# EAGLE design k1fm_wspr_tx-1.1 (EAGLE 9.2.2)
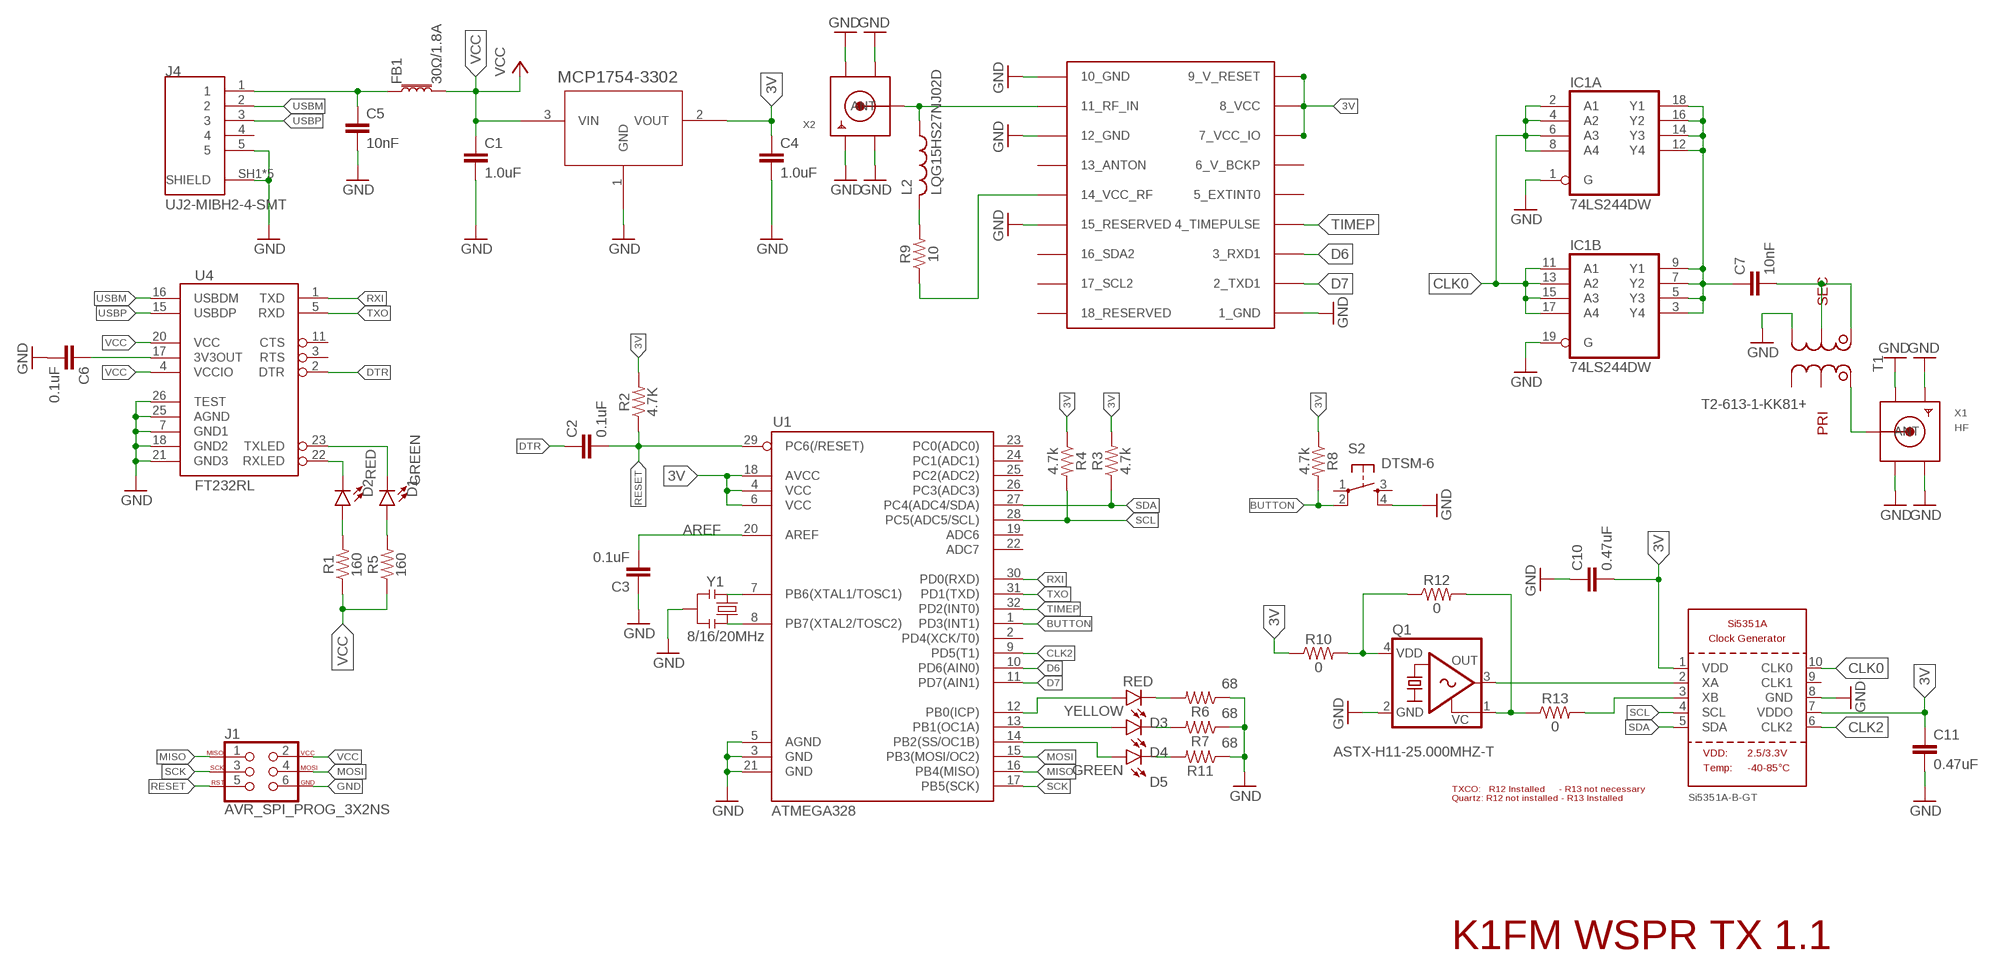
[diagram p0: schematic, sheet 1]

## Parts
C1  1.0uF  1.0UF-0603-16V-10%  [0603]
C2  0.1uF  0.1UF-0603-25V-5%  [0603]
C3  0.1uF  0.1UF-0603-25V-5%  [0603]
C4  1.0uF  1.0UF-0603-16V-10%  [0603]
C5  10nF  1.0UF-0603-16V-10%  [0603]
C6  0.1uF  0.1UF-0603-25V-5%  [0603]
C7  10nF  1.0UF-0603-16V-10%  [0603]
C10  0.47uF  0.1UF-0603-25V-5%  [0603]
C11  0.47uF  0.1UF-0603-25V-5%  [0603]
D1  GREEN  LED0603  [LED-0603]
D2  RED  LED0603  [LED-0603]
D3  RED  LED0603  [LED-0603]
D4  YELLOW  LED0603  [LED-0603]
D5  GREEN  LED0603  [LED-0603]
FB1  30Ω/1.8A  FERRITE_BEAD-0603  [0603]
GPS1  UBLOX_MAX  [UBLOX_MAX]
IC1  74LS244DW  [SO20W]
J1  AVR_SPI_PROG_3X2NS  [2X3-NS]
J4  UJ2-MIBH2-4-SMT  [CUI_UJ2-MIBH2-4-SMT]
L2  LQG15HS27NJ02D  INDUCTOR_0402_M  [RESC0402_M]
Q1  ASTX-H11-25.000MHZ-T  KXO-VCXO-SINE-84  [3.2X2.5_KXO-84]
R1  160  4.7KOHM-0603-1/10W-1%  [0603]
R2  4.7K  10KOHM-0603-1/10W-1%  [0603]
R3  4.7k  4.7KOHM-0603-1/10W-1%  [0603]
R4  4.7k  4.7KOHM-0603-1/10W-1%  [0603]
R5  160  4.7KOHM-0603-1/10W-1%  [0603]
R6  68  4.7KOHM-0603-1/10W-1%  [0603]
R7  68  4.7KOHM-0603-1/10W-1%  [0603]
R8  4.7k  4.7KOHM-0603-1/10W-1%  [0603]
R9  10  10KOHM-0603-1/10W-1%  [0603]
R10  0  4.7KOHM-0603-1/10W-1%  [0603]
R11  68  4.7KOHM-0603-1/10W-1%  [0603]
R12  0  4.7KOHM-0603-1/10W-1%  [0603]
R13  0  4.7KOHM-0603-1/10W-1%  [0603]
S2  DTSM-6  [DTSM-6]
T1  T2-613-1-KK81+  TT1-6  [KK81]
U1  ATMEGA328  ATMEGA168  [TQFP32-08]
U2  Si5351A-B-GT  SI5351A  [MSOP10]
U3  MCP1754X-XXXXX/C  [SOT-23A_MC]
U4  FT232RL  FT232RL-BASICSSOP  [SSOP28DB]
X1  HF  SMACONNECTOR_EDGE  [SMA_EDGELAUNCH]
X2  SMACONNECTOR_EDGE  [SMA_EDGELAUNCH]
Y1  8/16/20MHz  RESONATOR1:1  [RESONATOR-SMD-1:1]

## Nets
3V: C4.1 C10.2 C11.1 GPS1.7_VCC_IO GPS1.8_VCC GPS1.9_V_RESET R2.2 R3.2 R4.1 R8.1 R10.1 U1.4(VCC) U1.6(VCC) U1.18(AVCC) U2.1(VDD) U2.7(VDDO) U3.2(VOUT)
AREF: C3.2 U1.20(AREF)
BUTTON: R8.2 S2.2 U1.1(PD3(INT1))
CLK0: IC1.2(A:A1) IC1.4(A:A2) IC1.6(A:A3) IC1.8(A:A4) IC1.11(B:A1) IC1.13(B:A2) IC1.15(B:A3) IC1.17(B:A4) U2.10(CLK0)
CLK2: U1.9(PD5(T1)) U2.6(CLK2)
D6: GPS1.3_RXD1 U1.10(PD6(AIN0))
D7: GPS1.2_TXD1 U1.11(PD7(AIN1))
DTR: C2.1 U4.2(DTR)
GND: C1.2 C3.1 C4.2 C5.2 C6.2 C10.1 C11.2 GPS1.1_GND GPS1.10_GND GPS1.12_GND GPS1.15_RESERVED IC1.1(A:G) IC1.19(B:G) J1.6 J4.5 J4.SH1(SHIELD) J4.SH2(SHIELD) J4.SH3(SHIELD) J4.SH4(SHIELD) J4.SH5(SHIELD) Q1.2(GND) R6.1 R7.1 R11.1 S2.4 T1.1(S2) U1.3(GND) U1.5(AGND) U1.21(GND) U2.8(GND) U3.1(GND) U4.7(GND1) U4.18(GND2) U4.21(GND3) U4.25(AGND) U4.26(TEST) X1.GND@1(GND4) X1.GND@2(GND3) X1.GND@3(GND2) X1.GND@4(GND1) X2.GND@1(GND4) X2.GND@2(GND3) X2.GND@3(GND2) X2.GND@4(GND1) Y1.2
MISO: J1.1 U1.16(PB4(MISO))
MOSI: J1.4 U1.15(PB3(MOSI/OC2))
N$1: GPS1.11_RF_IN L2.1 X2.P(ANT)
N$2: D2.C U4.22(RXLED)
N$3: C7.1 IC1.3(B:Y4) IC1.5(B:Y3) IC1.7(B:Y2) IC1.9(B:Y1) IC1.12(A:Y4) IC1.14(A:Y3) IC1.16(A:Y2) IC1.18(A:Y1)
N$4: T1.4(P1) X1.P(ANT)
N$5: C7.2 T1.2(ST) T1.3(S1)
N$6: Q1.3(OUT) U2.2(XA)
N$7: D1.C U4.23(TXLED)
N$8: C5.1 FB1.1 J4.1
N$9: D2.A R1.2
N$10: D1.A R5.2
N$11: D3.A U1.12(PB0(ICP))
N$12: D4.A U1.13(PB1(OC1A))
N$13: D3.C R6.2
N$14: C6.1 U4.17(3V3OUT)
N$15: D4.C R7.2
N$16: Q1.4(VDD) R10.2 R12.1
N$17: L2.2 R9.2
N$18: GPS1.14_VCC_RF R9.1
N$21: D5.A U1.14(PB2(SS/OC1B))
N$22: D5.C R11.2
N$23: R13.2 U2.3(XB)
N$25: Q1.1(VC) R12.2 R13.1
N$28: U1.8(PB7(XTAL2/TOSC2)) Y1.3
N$29: U1.7(PB6(XTAL1/TOSC1)) Y1.1
RESET: C2.2 J1.5 R2.1 U1.29(PC6(/RESET))
RXI: U1.30(PD0(RXD)) U4.1(TXD)
SCK: J1.3 U1.17(PB5(SCK))
SCL: R4.2 U1.28(PC5(ADC5/SCL)) U2.4(SCL)
SDA: R3.1 U1.27(PC4(ADC4/SDA)) U2.5(SDA)
TIMEP: GPS1.4_TIMEPULSE U1.32(PD2(INT0))
TXO: U1.31(PD1(TXD)) U4.5(RXD)
USBM: J4.2 U4.16(USBDM)
USBP: J4.3 U4.15(USBDP)
VCC: C1.1 FB1.2 J1.2 R1.1 R5.1 U3.3(VIN) U4.4(VCCIO) U4.20(VCC)
Unconnected: GPS1.5_EXTINT0 GPS1.6_V_BCKP GPS1.13_ANTON GPS1.16_SDA2 GPS1.17_SCL2 GPS1.18_RESERVED J4.4 S2.1 S2.3 T1.5(PT) T1.6(P2) U1.2(PD4(XCK/T0)) U1.19(ADC6) U1.22(ADC7) U1.23(PC0(ADC0)) U1.24(PC1(ADC1)) U1.25(PC2(ADC2)) U1.26(PC3(ADC3)) U2.9(CLK1) U4.3(RTS) U4.11(CTS)

## Notes on the sheet
- TXCO:   R12 Installed     - R13 not necessary
  Quartz: R12 not installed - R13 Installed
- K1FM WSPR TX 1.1

## Power pins joined to a net without a drawn wire
GND: IC1.10(P:GND)
VCC: IC1.20(P:VCC)

## Library data of the parts
C1 C4 = SparkFun-Capacitors:1.0UF: 1µF ceramic capacitors A capacitor is a passive two-terminal electrical component used to store electrical energy temporarily in an electric field.; PROD_ID: CAP-00868
C2 C3 C6 = SparkFun-Capacitors:0.1UF: 0.1µF ceramic capacitors A capacitor is a passive two-terminal electrical component used to store electrical energy temporarily in an electric field.; PROD_ID: CAP-08604
C5 C7 = SparkFun-Capacitors:1.0UF: 1µF ceramic capacitors A capacitor is a passive two-terminal electrical component used to store electrical energy temporarily in an electric field.; PROD_ID: CAP-00868; VALUE: 1.0uF
C10 C11 = SparkFun-Capacitors:0.1UF: 0.1µF ceramic capacitors A capacitor is a passive two-terminal electrical component used to store electrical energy temporarily in an electric field.; PROD_ID: CAP-08604; VALUE: 0.1uF
D1-D5 = SparkFun-LED:LED: LED (Generic) Standard schematic elements and footprints for 5mm, 3mm, 1206, and 0603 sized LEDs. Generic LEDs with no color specified.
FB1 = SparkFun-Coils:FERRITE_BEAD: Ferrite Bead (blocks, cores, rings, chokes, etc.) Inductor with layers of ferrite used to suppress high frequencies. Often used to isolate high frequency noise. SparkFun Products: IOIO-OTG - V2.2 <https://www.sparkfun.com/products/13613> SparkFun SAMD21 Mini Breakout <https://www.sparkfun.com/products/13664> SparkFun 6 Degrees of Freedom Breakout - LSM6DS3 <https://www.sparkfun.com/products/13339> SparkFun SAMD21 Dev Breakout <https://www.sparkfun.com/products/13672>; PROD_ID: NDUC-07859
GPS1 = Ava:UBLOX_MAX: UBLOX MAX
IC1 = 74xx-us:74*244: Octal BUFFER and LINE DRIVER, 3-state
J1 = SparkFun-Connectors:AVR_SPI_PROG_3X2: AVR ISP 6 Pin This is the reduced ISP connector for AVR programming. Common on Arduino. This footprint will take up less PCB space and can be used with a 10-pin to 6-pin adapter such as SKU: BOB-08508 **Special note about "TEST_POINT" package. The stop mask is on the top side, so if you want your programming test points to be on the bottom of your board, make sure to place this package on the bottom side of the board. This also ensure that the orientation to program from the bottom side will be correct. SparkFun Products: SparkFun ISP Pogo Adapter <https://www.sparkfun.com/products/11591> - NS Tiny AVR Programmer <https://www.sparkfun.com/products/11801> -PTH
J4 = UJ2-MIBH2-4-SMT:UJ2-MIBH2-4-SMT: Micro B, USB 2.0, 1.8 A, Right Angle, Surface Mount (SMT), USB Receptacle; MANUFACTURER: CUI INC; PART_REV: 1.0; STANDARD: MANUFACTURER RECOMMENDATIONS
L2 = Nordic_nRF:INDUCTOR: Generic chip inductor
Q1 = crystal-geyer_V1_0:KXO-VCXO-SINE: VCXO : Sinewave - Serie Model Size l/w/h [mm] Frequency Range Frequency Stability Temp. Range [°C] Output AECQ 200 availabel Datasheet KXO-81 KXO-86 KXO-84 KXO-83 KXO-82 2.0/1.6/0.7 2.5/2.0/0.7 3.2/2.5/1.0 5.0/3.2/1.5 7.0/5.0/2.0 13,0 ~ 40,0 MHz 13,0 ~ 40,0 MHz 10,0 ~ 26,0 MHz 12,0 ~ 26,0 MHz 12,6 ~ 20,0 MHz ±10 … ±50ppm ±10 … ±50ppm ±10 … ±50ppm ±10 … ±50ppm ±10 … ±50ppm (*) -30°C …+75°C (*) -30°C …+75°C (*) -40°C …+85°C (*) -40°C …+85°C (*) -30°C …+80°C Sinewave Sinewave Sinewave Sinewave Sinewave - - - - - KXO-81.pdf <http://www.geyer-electronic.de/uploads/tx_userartikelfrequenz/GEYER-KXO-81-VCXO-sinewave.pdf> KXO-86.pdf <http://www.geyer-electronic.de/uploads/tx_userartikelfrequenz/GEYER-KXO-86-VCXO-sinewave.pdf> KXO-84.pdf <http://www.geyer-electronic.de/uploads/tx_userartikelfrequenz/GEYER-KXO-84-VCXO-sinewave.pdf> KXO-83.pdf <http://www.geyer-electronic.de/uploads/tx_userartikelfrequenz/GEYER-KXO-83-VCXO-sinewave.pdf> KXO-82.pdf <http://www.geyer-electronic.de/uploads/tx_userartikelfrequenz/GEYER-KXO-82-VCXO-sinewave.pdf> <http://www.geyer-electronic.de/fileadmin/template/img/logo-geyer-electronic.png> Details see: http://www.geyer-electronic.de/Frequenz-Produkte.9.0.html Created 2016-06-07, Hans Locher 2016 (C) Geyer Quartz Technology KXO81,KXO86,KXO84,KXO83,KXO82,2,0x1,6;2.0x1.6;2,5x2,0;2.5x2.0;3,2x2,5;3.2x2.5;5,0x3,2;5.0x3.2;7,0x5,0;7.0x5.0;2016;2520;3225;5032;7050
R1 R5-R7 R10-R13 = SparkFun-Resistors:4.7KOHM: 4.7kΩ resistor A resistor is a passive two-terminal electrical component that implements electrical resistance as a circuit element. Resistors act to reduce current flow, and, at the same time, act to lower voltage levels within circuits. - Wikipedia; PROD_ID: RES-07857; VALUE: 4.7k
R2 R9 = SparkFun-Resistors:10KOHM: 10kΩ resistor A resistor is a passive two-terminal electrical component that implements electrical resistance as a circuit element. Resistors act to reduce current flow, and, at the same time, act to lower voltage levels within circuits. - Wikipedia; PROD_ID: RES-00824; VALUE: 10k
R3 R4 R8 = SparkFun-Resistors:4.7KOHM: 4.7kΩ resistor A resistor is a passive two-terminal electrical component that implements electrical resistance as a circuit element. Resistors act to reduce current flow, and, at the same time, act to lower voltage levels within circuits. - Wikipedia; PROD_ID: RES-07857
S2 = switch-tact:DTSM-6
T1 = minicircuits:TT1-6
U1 = SparkFun:ATMEGA168
U2 = microbuilder:SI5351A: Si5351A 8kHz-160MHz I2C Clock Generator VDD: 2.5V or 3.3V Input Range: 25MHz or 27MHz XTAL User selectable internal input load capacitors: 6, 8 or 10 pF Output Impedance: 85 Ohm Output Load Capacitance: 5-15pF Operating Temperature: -40°C - 85°C Operating Current (3 outputs): 35mA Output buffer voltage (VDDO): 1.8, 2.5 or 3.3V Note: If VDDO is not used it should be connected to VDD. Unused clock out pins should be left floating.
U3 = MCP1754:MCP1754X-XXXXX/C
U4 = SparkFun-IC-Comms:FT232RL-BASIC: FT232RL USB UART This is the simplified version of the FT232RL unit. Only what you need, nothing you don't. FT232RL 4th Generation USB UART (USB <-> Serial) Controller. Datasheet <http://www.sparkfun.com/datasheets/IC/FT232R_v104.pdf> SparkFun Products Component <https://www.sparkfun.com/products/650> (COM-00650) SparkFun RedBot Mainboard <https://www.sparkfun.com/products/12097> (ROB-12097) SparkFun FTDI Basic Breakout - 5V <https://www.sparkfun.com/products/9716> (DEV-09716) SparkFun FTDI Basic Breakout - 3.3V <https://www.sparkfun.com/products/9873> (DEV-09873) Bus Pirate - v3.6a <https://www.sparkfun.com/products/12942> (TOL-12942) SparkFun USB to Serial Breakout - FT232RL <https://www.sparkfun.com/products/12731> (BOB-12731) SparkFun PicoBoard <https://www.sparkfun.com/products/11888> (WIG-11888) SparkFun RFID USB Reader <https://www.sparkfun.com/products/9963> (SEN-09963) LilyPad FTDI Basic Breakout - 5V <https://www.sparkfun.com/products/10275> (DEV-10275) SparkFun Stepoko <https://www.sparkfun.com/products/13899> (ROB-13899); PROD_ID: IC-00870
X1 X2 = adafruit:SMACONNECTOR: SMA Connector 90° DIP SMA Connector, 50 Ohm (4UConnector: 07259)
Y1 = Testing:RESONATOR: Resonator Small SMD resonator. This is the itty bitty 10/20MHz resonators with built in caps. CSTCE10M0G55 and CSTCE20M0V53. Footprint for SMD has been used in SFE production for years, and does work okay. 1:1 is an attempt to get larger fillets on the sides so it will be easier to inspect these solders in our AOI machine. The pads have been minimized to match the actual metal under the resonator. To see this relation, it includes an image import of the bottom side of the component. Imported to scale on layer 200.

## Board
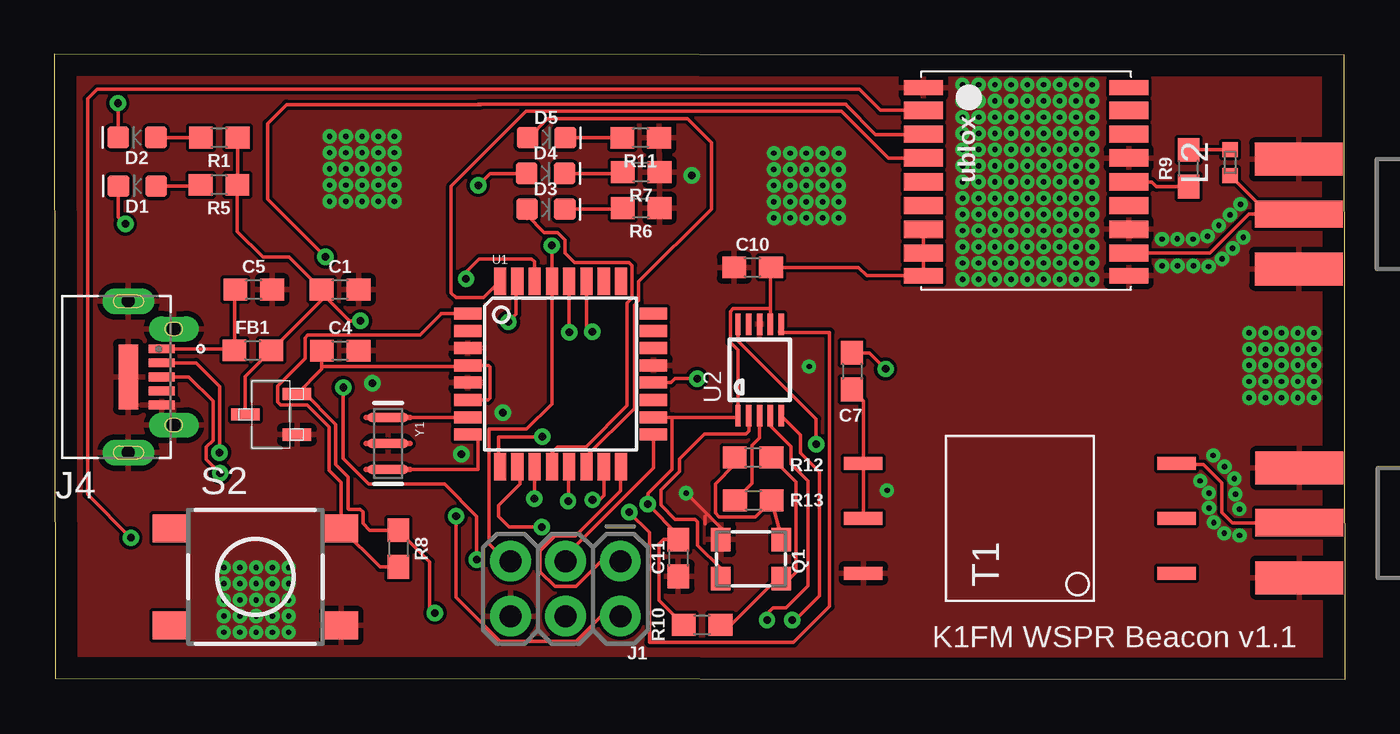
[diagram p1: board, top side]
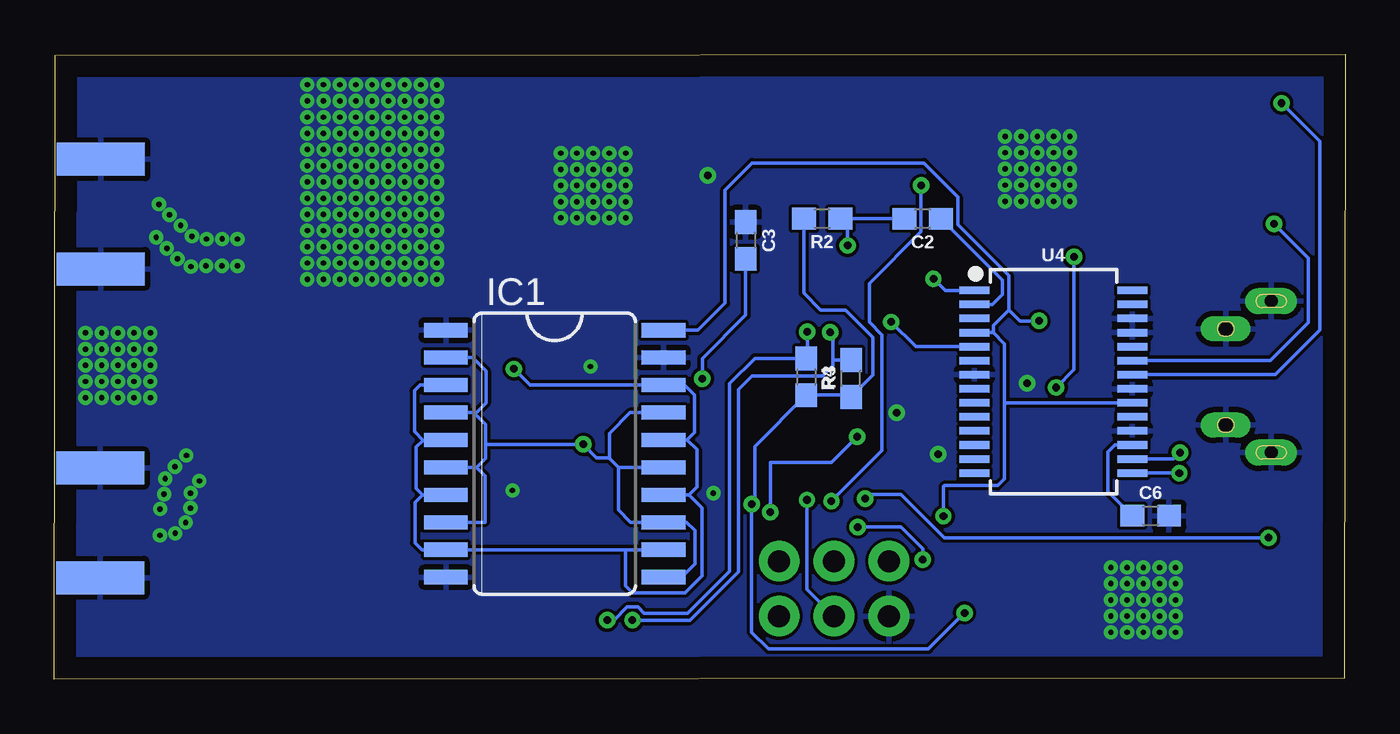
[diagram p2: board, bottom side, seen from below]

Size 59.73 x 28.94 mm. Coordinates in mm from the lower left corner, seen from the top.
Outline: 0.05,0.05 59.73,0 59.68,28.88 0,28.94 0.05,0.05
Copper layers (1*16): Top 0.035mm / dielectric 1.5mm / Bottom 0.035mm
Design rules "default *": minimum track width 6mil, minimum drill 0.25mm, track to track 6mil, track to pad 6mil, pad to pad 6mil, via to via 6mil, smd to smd 6mil, copper to edge 40mil, drill to drill 6mil, minimum pad ring 10mil, minimum via ring 8mil, stop-mask expansion 4mil, vias tented up to drill 0mil, thermal gap 10mil

### Footprints (pad centres in the part's own frame; a part is rotated, then mirrored left to right if it is on the bottom)
0603 = smd 1.1 x 1: 1 -0.85,0; 2 0.85,0
LED-0603 = smd 1 x 1: A -0.877,0; C 0.877,0
UBLOX_MAX = smd 1.8 x 0.7: 1_GND 4.95,-4.4; 9_V_RESET 4.95,4.3; 10_GND -4.55,4.3; 18_RESERVED -4.55,-4.4 | smd 1.8 x 0.8: 2_TXD1 4.95,-3.35; 3_RXD1 4.95,-2.25; 4_TIMEPULSE 4.95,-1.15; 5_EXTINT0 4.95,-0.05; 6_V_BCKP 4.95,1.05; 7_VCC_IO 4.95,2.15; 8_VCC 4.95,3.25; 11_RF_IN -4.55,3.25; 12_GND -4.55,2.15; 13_ANTON -4.55,1.05; 14_VCC_RF -4.55,-0.05; 15_RESERVED -4.55,-1.15; 16_SDA2 -4.55,-2.25; 17_SCL2 -4.55,-3.35
SO20W = smd 0.66 x 2.032: 1 -5.715,-5.029; 2 -4.445,-5.029; 3 -3.175,-5.029; 4 -1.905,-5.029; 5 -0.635,-5.029; 6 0.635,-5.029; 7 1.905,-5.029; 8 3.175,-5.029; 9 4.445,-5.029; 10 5.715,-5.029; 11 5.715,5.029; 12 4.445,5.029; 13 3.175,5.029; 14 1.905,5.029; 15 0.635,5.029; 16 -0.635,5.029; 17 -1.905,5.029; 18 -3.175,5.029; 19 -4.445,5.029; 20 -5.715,5.029
2X3-NS = drill 1.016 pad 1.88: 1 -2.54,-1.27; 2 -2.54,1.27; 3 0,-1.27; 4 0,1.27; 5 2.54,-1.27; 6 2.54,1.27
CUI_UJ2-MIBH2-4-SMT = smd 1.2 x 0.4: 1 0,0; 2 0,-0.65; 3 0,-1.3; 4 0,-1.95; 5 0,-2.6 | drill 0.6 pad 1.2 long: SH1 -1.55,2.2; SH4 -1.55,-4.8 | drill 0.65 pad 1.05 long: SH2 0.55,0.925; SH5 0.55,-3.525 | smd 0.9 x 3: SH3 -1.55,-1.3
RESC0402_M = smd 0.7 x 0.7: 1 -0.6,0; 2 0.6,0
3.2X2.5_KXO-84 = smd 0.9 x 1.1: 1 -1.4,-0.9; 2 1.4,-0.9; 3 1.4,0.9; 4 -1.4,0.9
DTSM-6 = smd 1.55 x 1.3: 1 -3.975,2.25; 2 3.975,2.25; 3 -3.975,-2.25; 4 3.975,-2.25
KK81 = smd 0.61 x 1.778: 1 -2.54,7.239; 2 0,7.239; 3 2.54,7.239; 4 2.54,-7.239; 5 0,-7.239; 6 -2.54,-7.239
TQFP32-08 = smd 1.27 x 0.559: 1 -4.293,2.8; 2 -4.293,2; 3 -4.293,1.2; 4 -4.293,0.4; 5 -4.293,-0.4; 6 -4.293,-1.2; 7 -4.293,-2; 8 -4.293,-2.8; 17 4.293,-2.8; 18 4.293,-2; 19 4.293,-1.2; 20 4.293,-0.4; 21 4.293,0.4; 22 4.293,1.2; 23 4.293,2; 24 4.293,2.8 | smd 0.559 x 1.27: 9 -2.8,-4.293; 10 -2,-4.293; 11 -1.2,-4.293; 12 -0.4,-4.293; 13 0.4,-4.293; 14 1.2,-4.293; 15 2,-4.293; 16 2.8,-4.293; 25 2.8,4.293; 26 2,4.293; 27 1.2,4.293; 28 0.4,4.293; 29 -0.4,4.293; 30 -1.2,4.293; 31 -2,4.293; 32 -2.8,4.293
MSOP10 = smd 0.25 x 1: 1 -1,-2.113; 2 -0.5,-2.113; 3 0,-2.113; 4 0.5,-2.113; 5 1,-2.113; 6 1,2.113; 7 0.5,2.113; 8 0,2.113; 9 -0.5,2.113; 10 -1,2.113
SOT-23A_MC = smd 0.559 x 1.321: 1 -0.94,-1.194; 2 0.94,-1.194; 3 0,1.194
SSOP28DB = smd 0.348 x 1.397: 1 -4.225,-3.656; 2 -3.575,-3.656; 3 -2.925,-3.656; 4 -2.275,-3.656; 5 -1.625,-3.656; 6 -0.975,-3.656; 7 -0.325,-3.656; 8 0.325,-3.656; 9 0.975,-3.656; 10 1.625,-3.656; 11 2.275,-3.656; 12 2.925,-3.656; 13 3.575,-3.656; 14 4.225,-3.656; 15 4.225,3.656; 16 3.575,3.656; 17 2.925,3.656; 18 2.275,3.656; 19 1.625,3.656; 20 0.975,3.656; 21 0.325,3.656; 22 -0.325,3.656; 23 -0.975,3.656; 24 -1.625,3.656; 25 -2.275,3.656; 26 -2.925,3.656; 27 -3.575,3.656; 28 -4.225,3.656
SMA_EDGELAUNCH = smd 4.064 x 1.524: GND@1 2.032,-2.54; GND@2 2.032,2.54 | smd 4.064 x 1.524 bottom: GND@3 2.032,2.54; GND@4 2.032,-2.54 | smd 4.064 x 1.27: P 2.032,0
RESONATOR-SMD-1:1 = smd 0.45 x 1.905: 1 -1.2,0; 2 0,0; 3 1.2,0

### Placement (x,y rotation side)
C1  13.23,18.04 0 top
C2  19.55,21.31 180 bottom
C3  27.74,20.31 270 bottom
C4  13.23,15.21 0 top
C5  9.24,18.04 0 top
C6  9.01,7.57 0 bottom
C7  36.9,14.26 270 top
C10  32.31,19.06 0 top
C11  28.87,5.62 270 top
D1  3.85,22.83 180 top
D2  3.84,25.08 180 top
D3  22.75,21.76 0 top
D4  22.74,23.41 0 top
D5  22.77,25.06 0 top
FB1  9.19,15.22 0 top
GPS1  45.16,22.98 180 top
IC1  36.58,10.45 270 bottom
J1  23.66,4.2 180 top
J4  4.99,15.3 0 top
L2  54.39,23.92 90 top
Q1  32.24,5.57 180 top
R1  7.64,25.07 180 top
R2  24.2,21.32 180 bottom
R3  24.95,14 270 bottom
R4  22.87,13.93 90 bottom
R5  7.63,22.88 180 top
R6  27.15,21.81 180 top
R7  27.15,23.47 180 top
R8  15.92,6.06 270 top
R9  52.47,23.65 90 top
R10  29.97,2.53 0 top
R11  27.13,25.06 180 top
R12  32.33,10.27 180 top
R13  32.34,8.29 180 top
S2  9.31,4.75 0 top
T1  44.67,7.46 90 top
U1  23.43,14.13 0 top
U2  32.63,14.32 0 top
U3  10.04,12.26 90 top
U4  13.51,13.78 270 bottom
X1  59.63,7.25 180 top
X2  59.6,21.53 180 top
Y1  15.45,10.92 270 top

### Tracks (layer width: path | path; a pad name or v marks a point on that pad's centre or on a via)
3V  (via drill 0.35)
  Top 0.152: C4.1 12.38,14.47 | U3.2 11.35,13.32 11.52,13.32 13.03,11.8 13.03,9.95 13.61,9.37 13.61,7.9 13.63,7.88 14.16,7.88 14.29,7.74 14.29,7.22 14.6,6.91 R8.1 17.38,5.45 17.38,3.31 v17.61,3.08 | C11.1 | U3.2 11.26,13.18 | U2.7 33.13,17.21 | 33.13,17.21 33.13,19.04 C10.2 | GPS1.7_VCC_IO GPS1.8_VCC GPS1.9_V_RESET 37.59,18.68 37.2,19.06 C10.2 | C10.2 33.23,19.14 | 19.08,12.92 19.1,12.9 U1.6 20.06,12.93 20.16,13.02 20.16,14.47 20.09,14.53 U1.4 19.07,14.47 12.38,14.47 | v27.46,8.11 | C11.1 28.87,6.7 v27.46,8.11 | R10.1 27.98,3.67 27.98,6.27 28.18,6.47 C11.1 | 27.98,7.58 v27.46,8.11 | U1.18 28.61,12.13 | 28.61,12.13 31.58,12.13 31.63,12.08 U2.1 31.63,15.24 31.28,15.59 31.28,17.03 31.41,17.16 33.08,17.16 33.13,17.21 | v27.46,8.11 27.46,8.6 28.58,9.72 28.58,12.1 28.61,12.13 | U3.2 12.38,14.36 12.38,14.47
  Bottom 0.152: 25.05,21.21 R2.2 25.05,17.87 24.27,17.09 23.13,17.09 21.85,15.81 21.85,14.09 R4.1 22.94,13.15 R3.2 27.32,10.78 27.32,8.25 v27.46,8.11 27.46,2.19 26.68,1.41 19.28,1.41 v17.61,3.08
AREF  (via drill 0.35)
  Top 0.152: U1.20 28.54,13.73 28.73,13.91 v29.74,13.91
  Bottom 0.152: v29.74,13.91 29.74,14.86 27.74,16.85 C3.2
BUTTON
  Top 0.152: 15.94,5.19 R8.2 15.08,5.21 S2.2 13.29,9.11 12.73,9.67 12.73,11.68 11.71,12.7 10.48,12.7 10.34,12.83 10.34,13.58 11.6,14.84 11.6,15.81 11.74,15.94 16.93,15.94 17.91,16.93 U1.1
CLK0  (via drill 0.35)
  Top 0.152: v35.24,10.88 35.24,12.05 31.63,15.67 U2.10
  Bottom 0.152: 40.18,9.81 IC1.6 | IC1.13 31.58,7.3 | IC1.17 33.08,12.35 34.04,11.39 34.04,10.26 | 34.04,10.26 34.06,10.24 33.63,9.81 | 33.63,9.81 IC1.15 | IC1.13 31.57,7.25 | IC1.11 30.7,4.73 30.09,5.34 30.09,6.9 30.47,7.27 IC1.13 | 40.18,9.81 39.77,10.22 39.77,10.91 | 41.55,12.3 IC1.4 40.32,12.35 | 39.77,10.91 39.77,11.81 40.32,12.35 | IC1.2 40.36,14.89 39.75,14.28 39.75,12.79 40.19,12.35 40.32,12.35 | 34.04,10.26 34.63,10.26 v35.24,10.88 39.74,10.88 39.77,10.91 | 40.18,9.81 39.8,9.43 39.8,7.27 | 41.56,7.22 41.58,7.25 | 41.58,7.25 IC1.8 | 39.8,7.27 41.56,7.27 41.58,7.25 | 39.8,7.27 | IC1.13 33.06,7.27 33.63,7.84 33.63,9.81
CLK2  (via drill 0.35)
  Top 0.152: v26.6,7.74 27.54,6.8 27.54,1.71 34.21,1.71 35.87,3.37 35.87,16.05 33.55,16.05 U2.6 | v22.59,11.23 20.55,11.23 20.55,10.05 U1.9
  Bottom 0.152: v26.6,7.74 26.6,10.05 23.77,10.05 v22.59,11.23
D6  (via drill 0.35)
  Top 0.152: v22.55,7.05 21.05,7.05 20.55,7.55 20.55,8.05 21.55,9.05 21.55,9.55 U1.10 | v19.55,5.55 19.55,7.55 18.05,9.05 14.55,9.05 13.37,10.23 v13.37,13.51 | 19.75,26.61 36.63,26.61 36.63,26.58 38,25.21 40.19,25.21 GPS1.3_RXD1 | 19.75,26.61 19.61,26.61 | v12.55,19.55 9.88,22.23 9.88,25.72 10.75,26.6 19.74,26.6 19.75,26.61
  Bottom 0.152: v22.55,7.05 20.55,7.05 19.55,6.05 v19.55,5.55 | v13.37,13.51 12.55,14.33 v12.55,19.55
D7  (via drill 0.35)
  Top 0.152: U1.11 22.23,8.38 v22.21,8.36 | v3.55,6.55 1.55,8.55 1.55,26.86 1.99,27.3 37.25,27.3 38.22,26.33 GPS1.2_TXD1 40.02,26.52
  Bottom 0.152: v3.55,6.55 18.55,6.55 20.55,8.55 22.05,8.55 v22.21,8.36
DTR
  Bottom 0.152: C2.1 15.87,18.48 15.87,17.82 16.34,17.35 U4.2
GND  (via drill 0.25, 0.35)
  Top 0.152: U1.3 19.05,15.55 19.05,15.39 | 30.1,7.21 30.1,7.54 | Q1.2 30.84,7.02 v29.23,8.62
  other vias: 20.76,12.35 29.49,23.32 14.71,13.7 18.83,10.42 43.52,27.52 44.27,27.52 45.02,27.52 45.77,27.52 46.52,27.52 47.27,27.52 48.02,27.52 48.02,26.77 47.27,26.77 46.52,26.77 45.77,26.77 45.02,26.77 44.27,26.77 43.52,26.77 42.77,27.52 42.77,26.77 42.02,26.77 42.02,27.52 42.02,26.02 42.77,26.02 43.52,26.02 44.27,26.02 45.02,26.02 45.77,26.02 46.52,26.02 47.27,26.02 48.02,26.02 42.02,25.27 42.77,25.27 43.52,25.27 44.27,25.27 45.02,25.27 45.77,25.27 46.52,25.27 47.27,25.27 48.02,25.27 42.02,24.52 42.77,24.52 43.52,24.52 44.27,24.52 45.02,24.52 45.77,24.52 46.52,24.52 47.27,24.52 48.02,24.52 48.02,23.77 47.27,23.77 46.52,23.77 45.77,23.77 45.02,23.77 44.27,23.77 43.52,23.77 42.77,23.77 42.02,23.77 42.02,23.02 42.77,23.02 43.52,23.02 44.27,23.02 45.02,23.02 45.77,23.02 46.52,23.02 47.27,23.02 48.02,23.02 48.02,22.27 47.27,22.27 46.52,22.27 45.77,22.27 45.02,22.27 44.27,22.27 43.52,22.27 42.77,22.27 42.02,22.27 42.02,21.52 42.77,21.52 43.52,21.52 44.27,21.52 45.02,21.52 45.77,21.52 46.52,21.52 47.27,21.52 48.02,21.52 48.02,20.77 47.27,20.77 46.52,20.77 45.77,20.77 45.02,20.77 44.27,20.77 43.52,20.77 42.77,20.77 42.02,20.77 48.02,20.02 48.02,19.27 48.02,18.52 47.27,18.52 47.27,19.27 47.27,20.02 46.52,20.02 46.52,19.27 46.52,18.52 45.77,18.52 45.77,19.27 45.77,20.02 45.02,20.02 45.02,19.27 45.02,18.52 44.27,18.52 44.27,19.27 44.27,20.02 43.52,20.02 43.52,19.27 43.52,18.52 51.24,20.37 51.95,20.38 52.67,20.37 53.35,20.51 53.87,21 51.25,19.13 51.97,19.14 52.7,19.14 53.39,19.1 54.02,19.46 54.51,19.95 53.01,9.19 53.61,10.36 54.14,9.85 54.82,7.89 54.59,9.29 54.64,8.57 53.41,8.62 54.12,6.76 53.64,7.26 53.42,7.93 38.53,8.75 42.77,20.02 42.02,20.02 42.02,19.27 42.77,19.27 42.77,18.52 42.02,18.52 54.83,6.67 55,20.45 54.39,21.49 54.88,21.99 34.92,14.48 55.28,16.04 56.03,16.04 56.78,16.04 57.53,16.04 58.28,16.04 58.28,15.29 57.53,15.29 56.78,15.29 56.03,15.29 55.28,15.29 58.28,14.54 58.28,13.79 58.28,13.04 57.53,13.04 57.53,13.79 57.53,14.54 56.78,14.54 56.78,13.79 56.78,13.04 56.03,14.54 55.28,14.54 55.28,13.79 56.03,13.79 56.03,13.04 55.28,13.04 33.29,24.35 34.04,24.35 34.79,24.35 35.54,24.35 36.29,24.35 36.29,23.6 35.54,23.6 34.79,23.6 34.04,23.6 33.29,23.6 36.29,22.85 36.29,22.1 36.29,21.35 35.54,21.35 35.54,22.1 35.54,22.85 34.79,22.85 34.79,22.1 34.79,21.35 34.04,22.85 33.29,22.85 33.29,22.1 34.04,22.1 34.04,21.35 33.29,21.35 12.75,25.12 13.5,25.12 14.25,25.12 15,25.12 15.75,25.12 15.75,24.37 15,24.37 14.25,24.37 13.5,24.37 12.75,24.37 15.75,23.62 15.75,22.87 15.75,22.12 15,22.12 15,22.87 15,23.62 14.25,23.62 14.25,22.87 14.25,22.12 13.5,23.62 12.75,23.62 12.75,22.87 13.5,22.87 13.5,22.12 12.75,22.12 7.85,5.18 8.6,5.18 9.35,5.18 10.1,5.18 10.85,5.18 10.85,4.43 10.1,4.43 9.35,4.43 8.6,4.43 7.85,4.43 10.85,3.68 10.85,2.93 10.85,2.18 10.1,2.18 10.1,2.93 10.1,3.68 9.35,3.68 9.35,2.93 9.35,2.18 8.6,3.68 7.85,3.68 7.85,2.93 8.6,2.93 8.6,2.18 7.85,2.18
  pour Top: 0.09,28.82 59.58,28.82 59.63,28.77 59.63,0.09 59.63,0.09 0.14,0.09 0.12,0.07
  pour Bottom: -0.01,28.94 59.58,28.94 59.66,28.86 59.66,0.03 59.68,0.02 0.09,0.02 0.06,0.04
MISO
  Top 0.152: U1.16 26.2,9.81 26.2,8.72 24.12,6.64 23.17,6.64 22.49,5.95 22.49,4.99 23.17,4.3 24.14,4.3 25.31,5.47 J1.1
MOSI  (via drill 0.35)
  Top 0.152: v24.91,8.31 25.22,8.31 25.43,8.52 U1.15
  Bottom 0.152: J1.4 24.91,4.18 v24.91,8.31
N$1
  Top 0.152: 57.55,21.51 X2.P 56.18,21.53 | 54.51,23.2 L2.1 56.18,21.53 | 56.18,21.53 55.25,21.53 53.45,19.73 GPS1.11_RF_IN
N$2  (via drill 0.35)
  Top 0.152: D2.C v2.96,26.65 v2.95,26.66
  Bottom 0.152: U4.22 3.25,14.1 1.19,16.17 1.19,24.9 v2.95,26.66
N$3  (via drill 0.35)
  Top 0.152: C7.1 37.71,15.11 v38.46,14.37
  Bottom 0.152: v38.46,14.37 37.71,13.62 IC1.18 30.56,13.62 30.1,13.16 30.1,11.42 30.44,11.08 | 30.44,11.08 IC1.16 | IC1.7 42.68,8.54 | 42.68,8.54 43.03,8.19 43.03,6.33 42.7,6 IC1.9 IC1.12 33.3,6 33.3,4.33 32.98,4.01 30.54,4.01 29.76,4.79 29.76,7.94 30.36,8.54 | 42.66,11.07 41.62,11.07 IC1.5 | 42.66,11.07 42.97,10.75 42.97,8.84 42.68,8.54 | IC1.3 42.81,13.62 43.06,13.37 43.06,11.47 42.66,11.07 | IC1.14 30.36,8.54 | 30.44,11.08 30,10.64 30,8.9 30.36,8.54
N$4
  Top 0.152: T1.4 51.96,9.95 53.16,9.95 54.02,9.09 54.02,7.74 54.5,7.25 X1.P
N$5
  Top 0.152: T1.2 T1.3 37.43,12.89 C7.2
N$6
  Top 0.152: U2.2 32.15,12.19 32.15,11.51 32.01,11.37 30.09,11.37 28.93,10.21 28.93,9.64 28.07,8.78 28.07,8.07 28.73,7.41 29.64,7.41 29.76,7.28 29.76,6.21 30.84,5.14 Q1.3
N$7  (via drill 0.35)
  Top 0.152: D1.C 2.98,21.39 v3.3,21.07
  Bottom 0.152: v3.3,21.07 1.71,19.49 1.71,16.51 3.47,14.75 U4.23
N$8
  Top 0.152: J4.1 8.27,15.3 FB1.1 8.34,17.99 C5.1
N$9
  Top 0.152: R1.2 4.72,25.07 D2.A
N$10
  Top 0.152: R5.2 6.73,22.83 D1.A
N$11
  Top 0.152: U1.12 23.03,10.49 23.3,10.77 24.6,10.77 26.5,12.67 26.5,17.42 26.73,17.65 26.73,19.15 26.6,19.29 24.07,19.29 23.64,19.72 23.64,20.33 23.28,20.68 22.67,20.68 21.87,21.48 | 21.87,21.33 21.87,21.48 | 21.87,21.48 D3.A
N$12  (via drill 0.35)
  Top 0.152: U1.13 23.79,9.8 23.79,8.27 v23.77,8.25 | v19.62,22.86 20.16,23.4 21.84,23.4 D4.A
  Bottom 0.152: v23.77,8.25 21.43,10.6 21.43,15.94 22.02,16.53 22.02,18.32 19.62,20.72 v19.62,22.86
N$13
  Top 0.152: R6.2 26.28,21.83 | 26.28,21.83 26.26,21.85 | D3.C 26.21,21.76 26.28,21.83
N$14
  Bottom 0.152: C6.1 11,8.71 11,10.52 10.66,10.85 U4.17
N$15
  Top 0.152: R7.2 26.24,23.41 D4.C
N$16
  Top 0.152: R10.2 31.31,2.53 33.46,4.67 33.57,4.67 Q1.4 34.03,4.67 34.32,4.95 34.32,9.13 R12.1
N$17
  Top 0.152: R9.2 52.49,24.52 L2.2
N$18
  Top 0.152: GPS1.14_VCC_RF 50.77,23.02 50.99,22.8 R9.1
N$21
  Top 0.152: U1.14 24.63,10.34 26.84,12.55 26.84,17.33 27.04,17.53 27.04,18.41 30.4,21.77 30.4,24.83 29.3,25.93 22.83,25.93 21.96,25.06 D5.A
N$22
  Top 0.152: R11.2 | D5.C R11.2 | R11.2
N$23
  Top 0.152: R13.2 32.28,9.08 32.28,10.82 32.63,11.17 U2.3
N$25
  Top 0.152: Q1.1 33.66,6.47 R13.1 32.44,7.53 30.76,7.53 30.58,7.71 30.58,9.05 31.48,9.95 R12.2
N$28
  Top 0.152: Y1.3 19.6,9.72 19.6,11.31 19.58,11.33 U1.8
N$29
  Top 0.152: Y1.1 19.12,12.12 U1.7
RESET  (via drill 0.35)
  Top 0.152: J1.5 20.93,5.47 20.12,6.28 20.12,11.57 20.13,11.58 21.86,11.58 23.03,12.75 U1.29 v23.03,20.07 v23.03,20.08
  Bottom 0.152: C2.2 R2.1 | R2.1 | v23.03,20.08 23.03,21 R2.1
RXI  (via drill 0.35)
  Top 0.152: U1.30 22.23,19.32 22.09,19.46 19.67,19.46 19.05,18.84 v19.05,18.54
  Bottom 0.152: v19.05,18.54 18.51,18 U4.1
SCK
  Top 0.152: J1.3 23.66,5.72 27.72,9.78 U1.17
SCL  (via drill 0.35)
  Top 0.152: v23.82,16.06 U1.28 | U2.4 33.15,12.19 33.15,11.7 34.08,10.77 34.08,9.98 34.87,9.19 34.87,4.33 33.85,3.31 33.25,3.31 32.97,3.03 v32.97,2.75
  Bottom 0.152: v23.82,16.06 23.82,16 23.71,15.89 23.71,14.78 | v32.97,2.75 30.32,2.75 28.08,4.98 28.08,13.41 27.46,14.04 24.19,14.04 23.71,14.52 23.71,14.78 | 23.71,14.78 R4.2
SDA  (via drill 0.35)
  Top 0.152: U1.27 24.63,16.35 v24.89,16.08 | v34.14,2.74 34.27,2.74 35.39,3.86 35.39,9.6 34.52,10.48 34.52,11.32 U2.5
  Bottom 0.152: v24.89,16.08 24.89,14.91 R3.1 | 24.95,14.62 R3.1 | v34.14,2.74 33.84,2.74 33.23,3.35 32.72,3.35 32.44,3.06 30.43,3.06 28.49,5.01 28.49,13.68 27.32,14.85 R3.1
TIMEP
  Top 0.152: U1.32 19.87,17.67 18.58,17.67 18.37,17.88 18.37,22.83 21.83,26.3 36.42,26.3 38.59,24.13 GPS1.4_TIMEPULSE
TXO  (via drill 0.35)
  Top 0.152: v21.01,16.54 21.38,16.9 21.38,18.37 U1.31
  Bottom 0.152: U4.5 19.87,15.4 v21.01,16.54
USBM  (via drill 0.35)
  Top 0.152: J4.2 6.57,14.65 7.65,13.57 v7.65,10.5
  Bottom 0.152: v7.65,10.5 7.95,10.2 U4.16
USBP  (via drill 0.35)
  Top 0.152: J4.3 6.23,14 7.35,12.88 7.35,11.05 7.05,10.75 7.05,10.19 v7.68,9.55
  Bottom 0.152: v7.68,9.55 U4.15
VCC  (via drill 0.35)
  Top 0.152: 12.38,17.89 12.38,17.56 FB1.2 8.84,14.03 U3.3 | 12.38,17.89 C1.1 10.88,19.54 9.67,19.54 8.48,20.73 R5.1 8.6,22.88 | 8.6,22.88 | R1.1 8.49,22.99 8.6,22.88 | J1.2 25.31,2.93 24.14,1.76 20.63,1.76 19.61,2.79 18.59,3.8 v18.59,7.55 | v14.17,16.59 13.68,16.59 12.38,17.89
  Bottom 0.152: 16.29,16.05 15.76,15.53 15.76,12.76 | 15.76,12.76 15.76,9.29 16.08,8.98 18.54,8.98 18.59,8.92 v18.59,7.55 | U4.20 15.72,12.8 15.76,12.76 | 31.64,16.25 IC1.20 29.95,16.16 28.69,17.41 28.69,22.64 27.44,23.89 19.49,23.89 17.92,22.33 17.92,21.05 15.57,18.7 15.57,17.1 | 16.29,16.05 16.29,16.38 15.57,17.1 | U4.4 16.29,16.05 | v14.17,16.59 15.06,16.59 15.57,17.1

### Text on the board
tNames: K1FM WSPR Beacon v1.1